# EasyEDA schematic christmas-garland_easyeda.json
TITLE: christmas-garland; REV: 3.0; Date: 2024-11-05; Sheet: 1/1; Drawn By: Владимир Шаталов; Company: Your Company
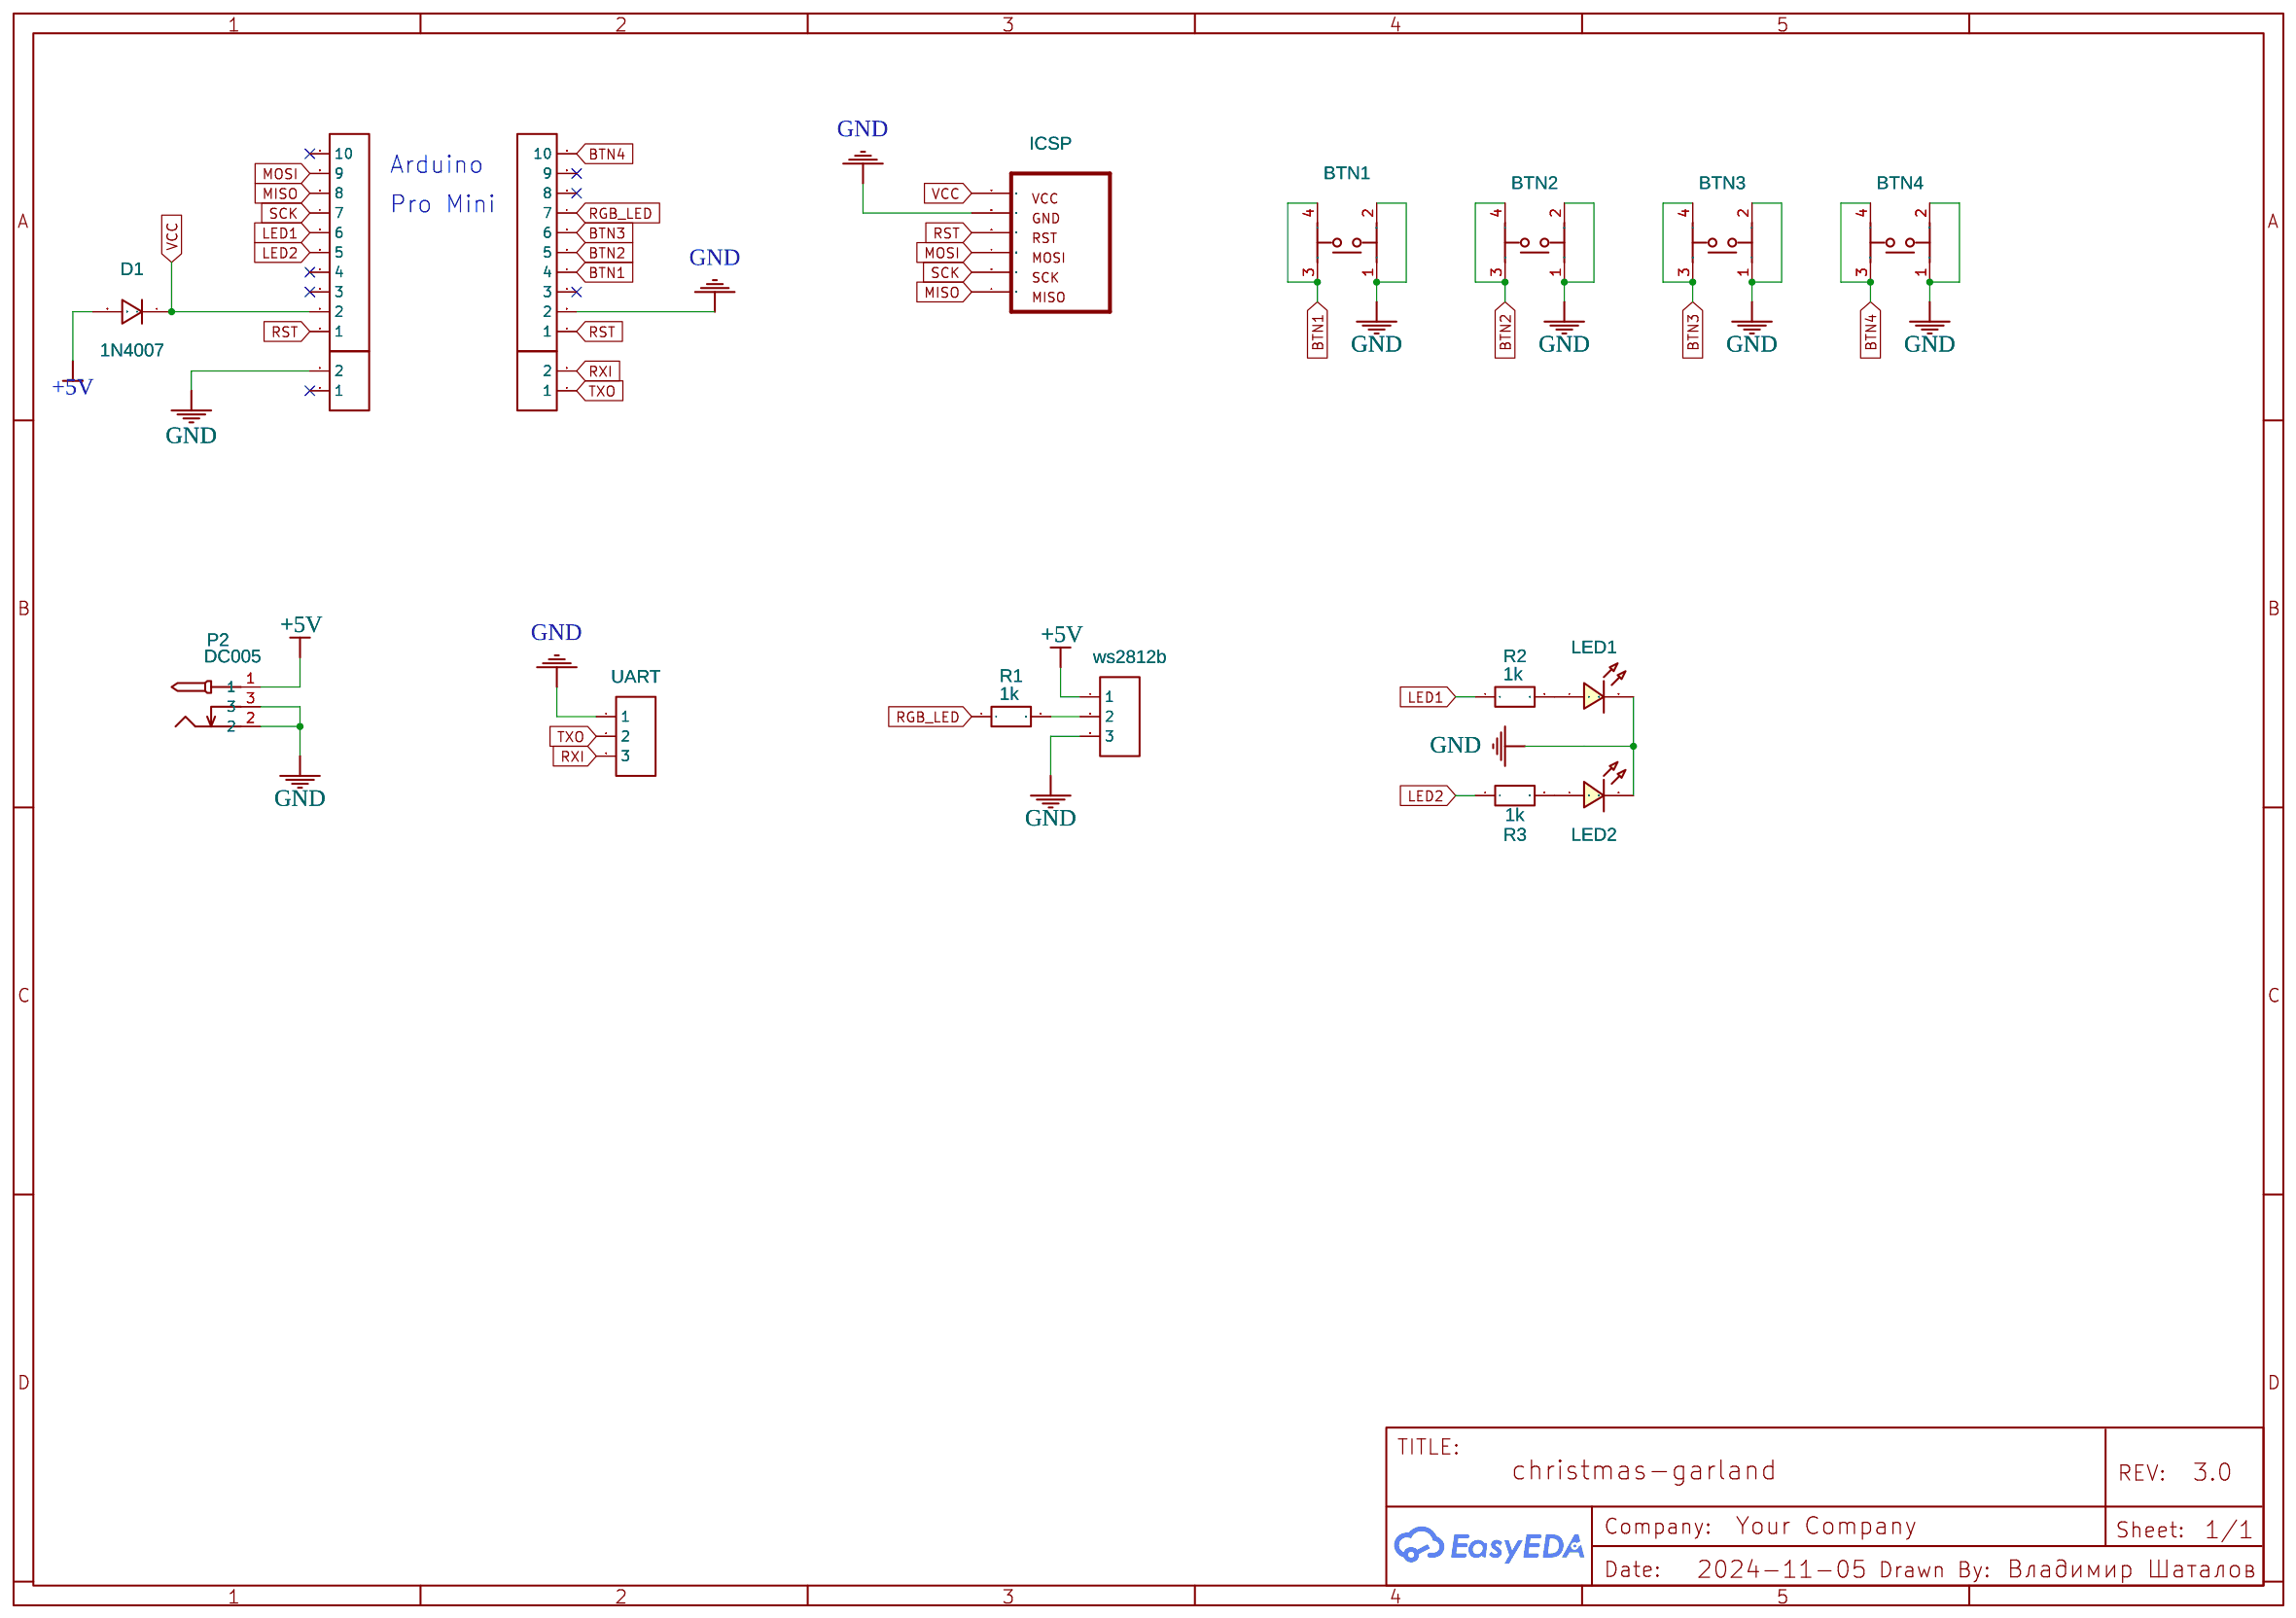
[diagram p0: schematic sheet]

## Parts
BTN1  Reset  [SW-DIP-6X6-3PX2P-TS]
BTN2  Reset  [SW-DIP-6X6-3PX2P-TS]
BTN3  Reset  [SW-DIP-6X6-3PX2P-TS]
BTN4  Reset  [SW-DIP-6X6-3PX2P-TS]
D1  1N4007  [SOD-123_L2.8-W1.8-LS3.7-RD]
H1  ws2812b  [HDR-F-2.54_1X3]
H2  HDR-F-2.54_1x2  [HDR-F-2.54_1X2]
H3  HDR-F-2.54_1x10  [HDR-F-2.54_1X10]
H4  HDR-F-2.54_1x10  [HDR-F-2.54_1X10]
H5  HDR-F-2.54_1x2  [HDR-F-2.54_1X2]
H6  UART  [HDR-F-2.54_1X3]
ICSP  SPI  [PA_M3X2]
LED1  LED-TH-3mm_G  [LED-TH_BD3.0_GREEN]
LED2  LED-TH-3mm_G  [LED-TH_BD3.0_GREEN]
P2  DC005  [DC005-2.5MM]
R1  1k  [R0805]
R2  1k  [R0805]
R3  1k  [R0805]

## Library data of the parts
BTN1-BTN4 = SWITCH-6X6-5.08X7.62: Supplier: LCSC; Supplier Part: C111609; Manufacturer: SOFNG; Manufacturer Part: TS-1102-5016; Contributor: LCSC
D1 = 1N4007W: Supplier: LCSC; Supplier Part: C328592; Manufacturer: BLUE ROCKET; Contributor: LCEDA_Lib
H1 H6 = HDR-F-2.54_1x3: Supplier Part: C146690; Supplier: LCSC; Contributor: LCEDA_Lib
H2 H5 = HDR-F-2.54_1x2: Supplier Part: C49661; Supplier: LCSC; Contributor: LCEDA_Lib
H3 H4 = HDR-F-2.54_1x10: Supplier Part: C35445; Supplier: LCSC; Contributor: LCEDA_Lib
ICSP = PA_AVR_SPI_PROGRAMMER_ARDUINO: PatternAgents Atmel AVR SPI Programmer Pattern; Contributor: PatternAgents
LED1 LED2 = LED-TH-3mm_G: Manufacturer: EVERLIGHT(台湾亿光); Manufacturer Part: 204-10SYGD/S530-E3; Supplier Part: C85161; Contributor: LCEDA_Lib
P2 = Three-pin power interface DC005 2.5MMsocket Bagged RHOS: Supplier Part: undefined; Supplier: LCSC; Manufacturer: ReliaPro; image: http://image.lceda.cn/szlcsc/C68942.jpg
R1-R3 = R_0805_EU: Contributor: LCEDA_Lib

## Nets
+5V: D1.2 H1.1 P2.1
GND: BTN1.1 BTN1.2 BTN2.1 BTN2.2 BTN3.1 BTN3.2 BTN4.1 BTN4.2 H1.3 H2.2 H4.2 H6.1 ICSP.6(GND) LED1.2 LED2.2 P2.2 P2.3
VCC: D1.1 H3.2 ICSP.2(VCC)
BTN1: BTN1.3 BTN1.4 H4.4
BTN2: BTN2.3 BTN2.4 H4.5
BTN3: BTN3.3 BTN3.4 H4.6
BTN4: BTN4.3 BTN4.4 H4.10
LED1: H3.6 R2.1
LED2: H3.5 R3.1
MISO: H3.8 ICSP.1(MISO)
MOSI: H3.9 ICSP.4(MOSI)
RGB_LED: H4.7 R1.1
RST: H3.1 H4.1 ICSP.5(RST)
RXI: H5.2 H6.3
SCK: H3.7 ICSP.3(SCK)
TXO: H5.1 H6.2
Net-(H1-2): H1.2 R1.2
Net-(LED1-1): LED1.1 R2.2
Net-(LED2-1): LED2.1 R3.2

Not connected (* = marked no-connect by the designer): H2 1*; H3 3* 4* 10*; H4 3* 8* 9*

## Notes on the sheet
- Arduino
- Pro Mini
